# Altium schematic sheet 3V3_to_2V5.SchDoc: 3V3 to 2V5 Converter
size B; DocumentNumber: 46; SheetNumber: 46; SheetTotal: 46
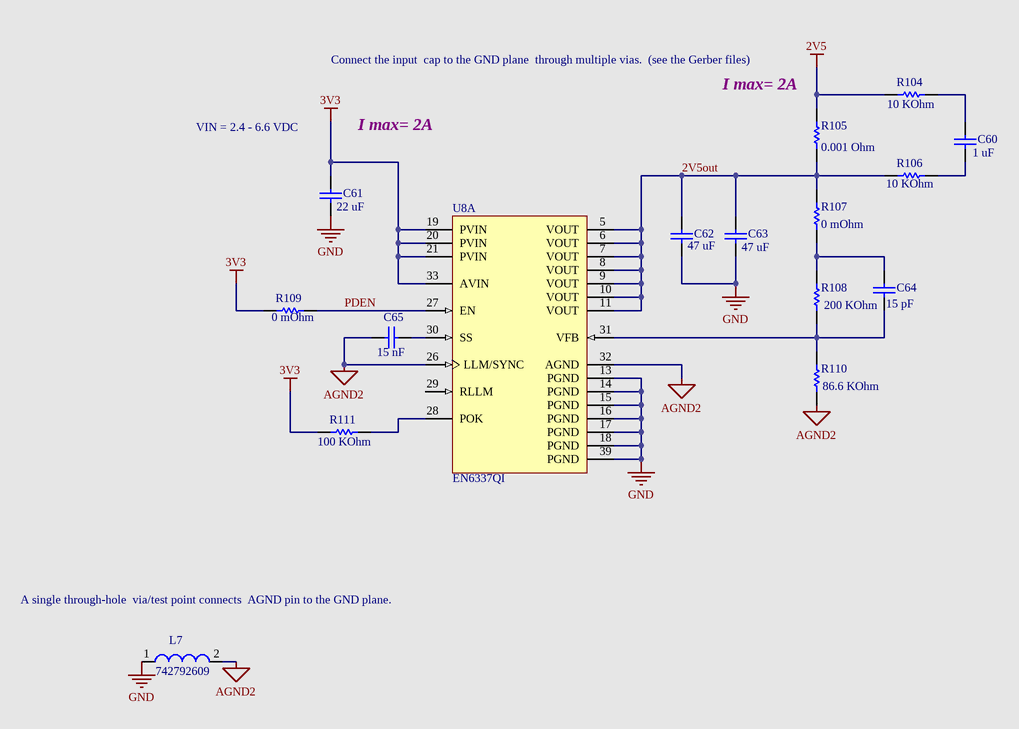
[diagram p0: 3V3_to_2V5.SchDoc]

## Parts
C60  Capacitance: 1 uF  [CAPC1005X33X10LL5]  (hidden comment: CGB2A1X5R1E105K033BC)
C61  Capacitance: 22 uF  [CAPC3216X180X55ML20T25]  (hidden comment: GRM31CR61E226KE15L)
C62  Capacitance: 47 uF  [CAPC3216X180X20ML20]  (hidden comment: C3216X5R1A476M160AB)
C63  Capacitance: 47 uF  [CAPC3216X180X20ML20]  (hidden comment: C3216X5R1A476M160AB)
C64  Capacitance: 15 pF  [CAPC1005X55X20ML5T10]  (hidden comment: ECJ-0EC1H150J)
C65  Capacitance: 15 nF  [CAPC1005X55X23ML05T8]  (hidden comment: VJ0402Y153JXQPW1BC)
L7  742792609  [SMD-0603]
R104  Resistance: 10 KOhm  [RESC1005X40X25NL05T05]  (hidden comment: ERJ-2RKF1002X)
R105  Resistance: 0.001 Ohm  [RESC3216X89X104LL25T25]  (hidden comment: WSLP12061L000FEA)
R106  Resistance: 10 KOhm  [RESC1005X40X25NL05T05]  (hidden comment: ERJ-2RKF1002X)
R107  Resistance: 0 mOhm  [RESC1005X40X25ML05T05]  (hidden comment: ERJ-2GE0R00X)
R108  Resistance: 200 KOhm  [RESC1005X40X25NL05T05]  (hidden comment: ERJ-2RKF2003X)
R109  Resistance: 0 mOhm  [RESC1005X40X25ML05T05]  (hidden comment: ERJ-2GE0R00X)
R110  Resistance: 86.6 KOhm  [RESC1005X40X25ML05T05]  (hidden comment: ERJ-2RKF8662X)
R111  Resistance: 100 KOhm  [RESC1005X40X25LL05T05]  (hidden comment: ERJ-2RKF1003X)
U8  EN6337QI  [ALTR-QFN-38_A-190_D1-193_V]  (part A of 2)

## Nets
2V5: R104.2 R105.2
3V3: C61.2 R109.1 R111.1 U8.19(PVIN) U8.20(PVIN) U8.21(PVIN) U8.33(AVIN)
AGND2: C65.1 L7.2 R110.1 U8.26(LLM/SYNC) U8.32(AGND)
GND: C61.1 C62.1 C63.1 L7.1 U8.13(PGND) U8.14(PGND) U8.15(PGND) U8.16(PGND) U8.17(PGND) U8.18(PGND) U8.39(PGND)
2V5out: C62.2 C63.2 R105.1 R106.2 R107.1 U8.5(VOUT) U8.6(VOUT) U8.7(VOUT) U8.8(VOUT) U8.9(VOUT) U8.10(VOUT) U8.11(VOUT)
PDEN: R109.2 U8.27(EN)
NetC60_1: C60.1 R106.1
NetC60_2: C60.2 R104.1
NetC64_1: C64.1 R108.1 R110.2 U8.31(VFB)
NetC64_2: C64.2 R107.2 R108.2
NetC65_2: C65.2 U8.30(SS)
NetR111_2: R111.2 U8.28(POK)

Not connected (* = marked no-connect by the designer): U8 29(RLLM)

## Notes on the sheet
- Connect the input  cap to the GND plane  through multiple vias.  (see the Gerber files)
- VIN = 2.4 - 6.6 VDC
- I max= 2A
- (near R105) I max= 2A
- A single through-hole  via/test point connects  AGND pin to the GND plane.
- Title
- Size:
- Date:
- B
- Number:
- Time:
- Revision:
- Sheet
- of
- File:

## Library data of the parts
C60 = CMP-1663-00006-2: Chip Capacitor, 1 uF, +/- 10%, 25 V, -55 to 85 degC, 0402 (1005 Metric), RoHS, Tape and Reel; Tolerance: 10%; PackageDescription: 2-Pin Surface Mount Device, Body 1 x 0.5 mm; PartNumber: CGB2A1X5R1E105K033BC; Case Code (Metric): 1005; DatasheetVersion: 04/2015; RoHSCompliant: True; Max Operating Temperature: 85 degC; ComponentLink2URL: https://product.tdk.com/info/en/catalog/datasheets/mlcc_commercial_lowprofile_en.pdf; Package Quantity: 1; Width: 0.02 inch; Case/Package: 0402; Case Code (Imperial): 0402; Packaging: Tape and Reel; Length: 0.039 inch; Min Operating Temperature: -55 degC; Mounting Technology: Surface Mount; ComponentLink2Description: Datasheet; ComponentLink1URL: http://www.tdk.com/; ComponentLink1Description: Manufacturer URL
C61 = CMP-1662-00010-2: Chip Capacitor, 22 uF, +/- 10%, 25 V, -55 to 85 degC, 1206 (3216 Metric), RoHS, Tape and Reel; Voltage Rating (DC): 25 V; Case\/Package: 1206; Type (Capacitors): X5R; Tolerance: 10%; Max Operating Temperature: 85 degC; Package Quantity: 2000; Voltage Rating: 25 V; Case Code (Metric): 3216; Length: 3.2 mm; PackageDescription: 2-Pin Surface Mount Device, Body 3.2 x 1.6 mm; ComponentLink1Description: Manufacturer URL; Case Code (Imperial): 1206; ComponentLink1URL: http://www.murata.com/; Radiation Hardening: No; Height: 1.6 mm; Width: 1.6 mm; DatasheetVersion: 03/2016; Min Operating Temperature: -55 degC; Mount: Surface Mount; REACH SVHC: No SVHC; PackageReference: 1206; ComponentLink2URL: http://search.murata.co.jp/Ceramy/image/img/A01X/G101/ENG/GRM31CR61E226KE15-01.pdf; Packaging: Tape and Reel; RoHSCompliant: true; ComponentLink2Description: Datasheet; Mounting Technology: Surface Mount; PartNumber: GRM31CR61E226KE15L; Pins: 2
C62 C63 = CMP-1663-00005-1: Chip Capacitor, 47 uF, +/- 20%, 10 V, -55 to 85 degC, 1206 (3216 Metric), RoHS, Tape and Reel; Voltage Rating (DC): 10 V; Type (Capacitors): X5R; Case\/Package: 1206; Tolerance: 20%; Voltage Rating: 10 V; Packaging: Tape and Reel; ComponentLink2URL: https://product.tdk.com/info/en/catalog/datasheets/mlcc_commercial_general_en.pdf; Min Operating Temperature: -55 degC; Length: 3.2 mm; Radiation Hardening: No; Mounting Technology: Surface Mount; PackageDescription: 2-Pin Surface Mount Device, Body 3.2 x 1.6 mm; Max Operating Temperature: 85 degC; Case Code (Metric): 3216; ComponentLink1URL: http://www.tdk.com/; DatasheetVersion: 03/2015; Mount: Surface Mount; Case Code (Imperial): 1206; Package Quantity: 2000; ComponentLink2Description: Datasheet; PackageReference: 3216; Height: 1.6 mm; RoHSCompliant: true; Width: 1.6 mm; ComponentLink1Description: Manufacturer URL
C64 = CMP-1665-00025-1: Chip Capacitor,15 pF, +/- 5%, 50 V, -55 to 125 degC, 0402 (1005 Metric), RoHS, Tape and Reel; Case\/Package: 0402; Type (Capacitors): C0G; Voltage Rating: 50 V; Tolerance: 5%; Mount: Surface Mount; Length: 0.039 inch; ComponentLink1Description: Manufacturer URL; Height: 0.5 mm; PackageReference: 0402; DatasheetVersion: 09/2008; Case Code (Metric): 1005; ComponentLink2URL: http://www.mouser.com/ds/2/315/panasonic_abj0000ce4-327307.pdf; Width: 0.02 inch; Mounting Technology: Surface Mount; Case Code (Imperial): 0402; PackageDescription: 2-Pin Surface Mount Device, Body 1 x 0.5 mm; Packaging: Tape and Reel; ComponentLink1URL: http://www.panasonic.com/; RoHSCompliant: true; Max Operating Temperature: 125 degC; Package Quantity: 10000; Min Operating Temperature: -55 degC; ComponentLink2Description: Datasheet
C65 = CMP-1666-00015-3: Chip Capacitor, 15 nF, +/- 5%, 10 V, -55 to 125 degC, 0402 (1005 Metric), RoHS, Tape and Reel; Voltage Rating (DC): 10 V; Type (Capacitors): X7R; Case\/Package: 0402; DatasheetVersion: 07/2016; ComponentLink1Description: Manufacturer URL; ComponentLink1URL: http://www.vishay.com/; PackageDescription: 2-Pin Surface Mount Device, Body 1 x 0.5 mm; ComponentLink2URL: http://www.vishay.com/docs/28548/vjw1bcbascomseries.pdf; ComponentLink2Description: Datasheet; Mounting Technology: Surface Mount; Length: 1 mm; PartNumber: VJ0402Y153JXQPW1BC; RoHSCompliant: true; Package Quantity: 50000; Min Operating Temperature: -55 degC; Case Code (Metric): 1005; Max Operating Temperature: 125 degC; Width: 0.5 mm; Tolerance: 5%; Packaging: Tape and Reel; Case Code (Imperial): 0402; Height: 0.5 mm; PackageReference: 0402; Mount: Surface Mount; Pins: 2; Voltage Rating: 10 V
L7 = CMP-0220-00193-1: SMD EMI Suppression Ferrite Bead WE-CBF, Z = 30 Ohm; Impedance: 30 Ohm; ComponentLink2URL: http://www.we-online.de/katalog/media/pdf/742792609.pdf; ComponentLink1URL: http://www.we-online.com; ComponentLink2Description: Datasheet; PackageDescription: Chip Inductor, 2-Leads, Body 1.6 x 0.8 mm; ComponentLink1Description: Manufacturer Link; PackageReference: SMD-0603; DatasheetVersion: Dec-2005; PackageVersion: 2009
R104 R106 = CMP-2002-00607-3: Chip Resistor, 10 KOhm, +/- 1%, 100 mW, -55 to 155 degC, 0402 (1005 Metric), RoHS, Tape and Reel; Manufacturer: Basic Passives; Voltage Rating: 50 V; Power Rating: 100 mW; Case\/Package: 0402; Case Code (Imperial): 0402; Min Operating Temperature: -55 degC; PartNumber: ERJ-2RKF1002X; Mounting Technology: Surface Mount; Length: 1 mm; Packaging: Tape and Reel; ComponentLink1Description: Manufacturer URL; Mount: Surface Mount; Package Quantity: 10000; Max Operating Temperature: 155 degC; Case Code (Metric): 1005; Height: 0.35 mm; ComponentLink1URL: http://www.panasonic.com/; Tolerance: 1%; REACH SVHC: Yes; RoHSCompliant: true; Width: 0.5 mm; PackageDescription: 2-Pin Surface Mount Device, Body 1 x 0.5 mm; Radiation Hardening: No; PackageReference: 0402; ComponentLink2Description: Datasheet; DatasheetVersion: 04/2015; ComponentLink2URL: http://industrial.panasonic.com/cdbs/www-data/pdf/RDA0000/AOA0000C86.pdf; Pins: 2
R105 = CMP-1666-00018-2: Chip Resistor, 0.001 Ohm, +/- 1%, 1 W, -65 to 170 degC, 1206 (3216 Metric), RoHS, Tape and Reel; Tolerance: 1%; RoHSCompliant: True; Mounting Technology: Surface Mount; ComponentLink1URL: http://www.vishay.com/; Min Operating Temperature: -65 degC; Height: 0.635 mm; ComponentLink2URL: http://www.farnell.com/datasheets/2049155.pdf; Length: 3.2 mm; ComponentLink2Description: Datasheet; ComponentLink1Description: Manufacturer URL; DatasheetVersion: 04/2015; Case Code (Imperial): 1206; Max Operating Temperature: 170 degC; Packaging: Tape and Reel; Case/Package: 1206; Width: 1.6 mm; PartNumber: WSLP12061L000FEA; REACH SVHC: Unknown; PackageDescription: 2-Pin Surface Mount Device, Body 3.2 x 1.6 mm; Case Code (Metric): 3216
R107 R109 = CMP-2002-00429-3: Chip Resistor, 0 mOhm, +/- 5%, 100 mW, -55 to 155 degC, 0402 (1005 Metric), RoHS, Tape and Reel; Manufacturer: Basic Passives; Power Rating: 100 mW; Voltage Rating: 50 V; Case\/Package: 0402; Max Operating Temperature: 155 degC; Tolerance: 5%; PartNumber: ERJ-2GE0R00X; Case Code (Imperial): 0402; Package Quantity: 10000; Length: 1 mm; Mounting Technology: Surface Mount; ComponentLink1URL: http://www.panasonic.com/; Height: 0.35 mm; Width: 0.5 mm; Min Operating Temperature: -55 degC; Case Code (Metric): 1005; RoHSCompliant: true; REACH SVHC: Unknown; ComponentLink1Description: Manufacturer URL; Packaging: Tape and Reel; Mount: Surface Mount; PackageDescription: 2-Pin Surface Mount Device, Body 1 x 0.5 mm; PackageReference: 0402; ComponentLink2URL: http://industrial.panasonic.com/cdbs/www-data/pdf/RDA0000/AOA0000C84.pdf; DatasheetVersion: 03/2015; Radiation Hardening: No; Pins: 2; ComponentLink2Description: Datasheet
R108 = CMP-2002-00760-3: Chip Resistor, 200 KOhm, +/- 1%, 100 mW, -55 to 155 degC, 0402 (1005 Metric), RoHS, Tape and Reel; Manufacturer: Basic Passives; Power Rating: 100 mW; Voltage Rating: 50 V; Case\/Package: 0402; ComponentLink1Description: Manufacturer URL; PackageDescription: 2-Pin Surface Mount Device, Body 1 x 0.5 mm; RoHSCompliant: true; PartNumber: ERJ-2RKF2003X; Max Operating Temperature: 155 degC; Width: 0.5 mm; Mounting Technology: Surface Mount; Package Quantity: 10000; REACH SVHC: No SVHC; Packaging: Tape and Reel; Length: 1 mm; Mount: Surface Mount; ComponentLink1URL: http://www.panasonic.com/; Case Code (Imperial): 0402; Min Operating Temperature: -55 degC; Height: 0.35 mm; Tolerance: 1%; Case Code (Metric): 1005; DatasheetVersion: 04/2015; ComponentLink2URL: http://industrial.panasonic.com/cdbs/www-data/pdf/RDA0000/AOA0000C86.pdf; ComponentLink2Description: Datasheet; PackageReference: 0402; Radiation Hardening: No; Pins: 2
R110 = CMP-2002-01090-3: Chip Resistor, 86.6 KOhm, +/- 1%, 100 mW, -55 to 155 degC, 0402 (1005 Metric), RoHS, Tape and Reel; Manufacturer: Basic Passives; Voltage Rating: 50 V; Power Rating: 100 mW; Case\/Package: 0402; Min Operating Temperature: -55 degC; REACH SVHC: Yes; PartNumber: ERJ-2RKF8662X; Width: 0.5 mm; ComponentLink1URL: http://www.panasonic.com/; Case Code (Imperial): 0402; Packaging: Tape and Reel; Mounting Technology: Surface Mount; RoHSCompliant: true; Max Operating Temperature: 155 degC; Length: 1 mm; Case Code (Metric): 1005; PackageDescription: 2-Pin Surface Mount Device, Body 1 x 0.5 mm; ComponentLink1Description: Manufacturer URL; Tolerance: 1%; Package Quantity: 10000; Mount: Surface Mount; Height: 0.35 mm; ComponentLink2Description: Datasheet; ComponentLink2URL: http://industrial.panasonic.com/cdbs/www-data/pdf/RDA0000/AOA0000C86.pdf; DatasheetVersion: 04/2015; Pins: 2; PackageReference: 0402
R111 = CMP-2002-00608-3: Chip Resistor, 100 KOhm, +/- 1%, 100 mW, -55 to 155 degC, 0402 (1005 Metric), RoHS, Tape and Reel; Manufacturer: Basic Passives; Voltage Rating: 50 V; Power Rating: 100 mW; Case\/Package: 0402; Height: 0.35 mm; ComponentLink1Description: Manufacturer URL; Packaging: Tape and Reel; Min Operating Temperature: -55 degC; RoHSCompliant: true; PackageDescription: 2-Pin Surface Mount Device, Body 1 x 0.5 mm; Mount: Surface Mount; Package Quantity: 10000; Max Operating Temperature: 155 degC; ComponentLink1URL: http://www.panasonic.com/; Tolerance: 1%; Mounting Technology: Surface Mount; PartNumber: ERJ-2RKF1003X; Case Code (Metric): 1005; Case Code (Imperial): 0402; REACH SVHC: Yes; Length: 1 mm; Width: 0.5 mm; DatasheetVersion: 04/2015; Pins: 2; ComponentLink2Description: Datasheet; ComponentLink2URL: http://industrial.panasonic.com/cdbs/www-data/pdf/RDA0000/AOA0000C86.pdf; PackageReference: 0402; Radiation Hardening: No
U8 = CMP-1689-00002-3: PowerSoC Voltage Mode Synchronous PWM Buck with Integrated Inductor, 2.5 to 6.6 V Input, -40 to 85 degC, 38-Pin QFN, RoHS, Tape and Reel; Output Current: 3 A; PackageDescription: 38-Pin Quad Flat No-Leads Package, Body 7 x 4 mm, Pitch 0.5 mm, Thermal Pad 2.6 x 1.94 mm; ComponentLink2Description: Datasheet; PartNumber: EN6337QI; DatasheetVersion: Rev. E; ComponentLink1Description: Manufacturer URL; ComponentLink1URL: https://www.altera.com/; Mounting Technology: Surface Mount; ComponentLink2URL: https://www.altera.com/content/dam/altera-www/global/en_US/pdfs/literature/ds/en6337qi_05800.pdf; Width: 0.16 inch; Pins: 38; Packaging: Tape and Reel; Package Quantity: 500; Mount: Surface Mount; Radiation Hardening: No; RoHSCompliant: True; Max Operating Temperature: 85 degC; Min Operating Temperature: -40 degC; Height: 0.07 inch; Length: 0.28 inch